# Altium schematic sheet HydrophoneGroup2FilterAndAmpCircuit.SchDoc
size C
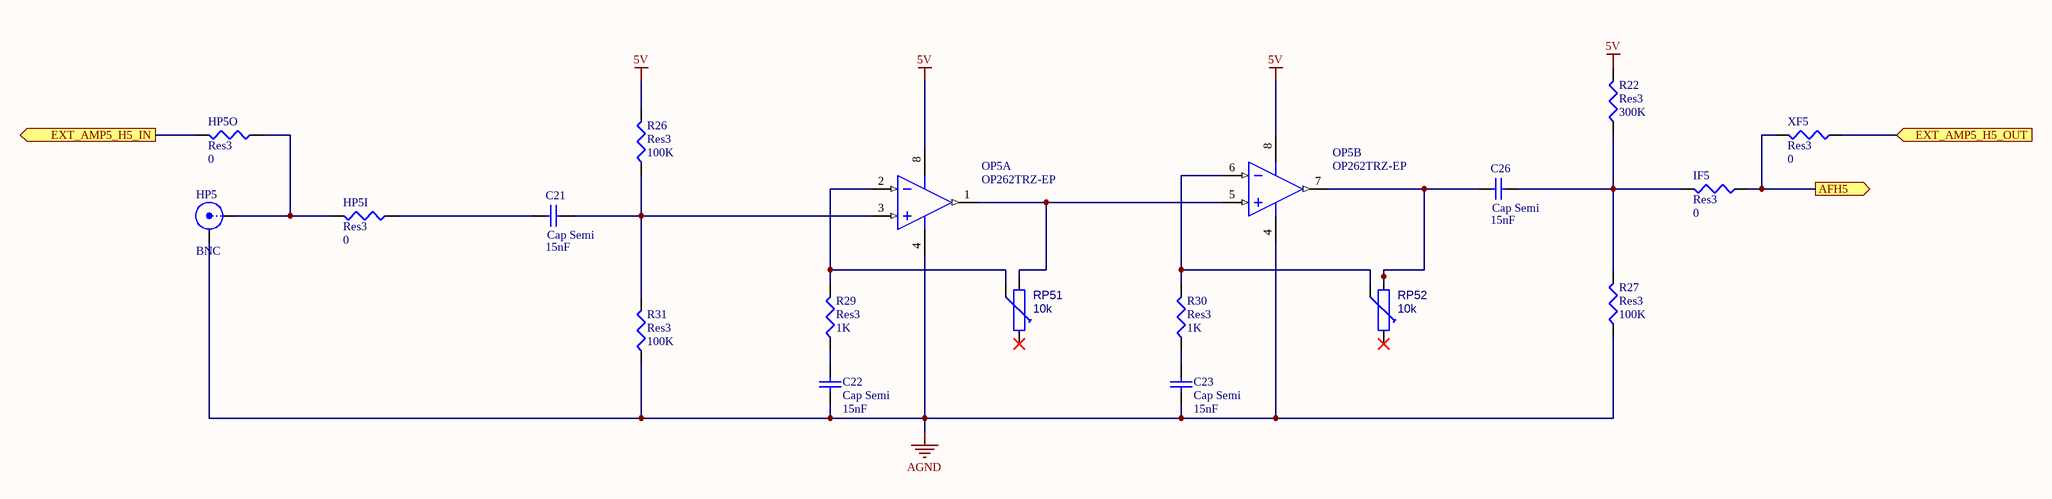
[diagram p0: HydrophoneGroup2FilterAndAmpCircuit.SchDoc]

## Parts
C21  Cap Semi  value 15nF  [C0805]
C22  Cap Semi  value 15nF  [C0805]
C23  Cap Semi  value 15nF  [C0805]
C26  Cap Semi  value 15nF  [C0805]
HP5  BNC  [BNC_RA CON]
HP5I  Res3  value 0  [J1-0603]
HP5O  Res3  value 0  [J1-0603]
IF5  Res3  value 0  [J1-0603]
OP5  OP262TRZ-EP  [ADI-R-8_N]  (parts A,B of 2)
R22  Res3  value 300K  [J1-0603]
R26  Res3  value 100K  [J1-0603]
R27  Res3  value 100K  [J1-0603]
R29  Res3  value 1K  [J1-0603]
R30  Res3  value 1K  [J1-0603]
R31  Res3  value 100K  [J1-0603]
RP51  10k  [Trim_Bourns3296]
RP52  10k  [Trim_Bourns3296]
XF5  Res3  value 0  [J1-0603]

## Ports
AFH5 (out), EXT_AMP5_H5_IN (out), EXT_AMP5_H5_OUT (in)

## Nets
5V: OP5.8(+V) R22.2 R26.2
AGND: C22.1 C23.1 HP5.2(Y) OP5.4(-V) R27.1 R31.1
AFH5: IF5.1 XF5.2 ; port AFH5
EXT_AMP5_H5_IN: HP5O.2 ; port EXT_AMP5_H5_IN
EXT_AMP5_H5_OUT: XF5.1 ; port EXT_AMP5_H5_OUT
NetC21_1: C21.1 HP5I.1
NetC21_2: C21.2 OP5.3(+IN_A) R26.1 R31.2
NetC22_2: C22.2 R29.1
NetC23_2: C23.2 R30.1
NetC26_1: C26.1 OP5.7(OUT_B) RP52.1
NetC26_2: C26.2 IF5.2 R22.1 R27.2
NetHP5_1: HP5.1(X) HP5I.2 HP5O.1
NetOP5_1: OP5.1(OUT_A) OP5.5(+IN_B) RP51.1
NetOP5_2: OP5.2(-IN_A) R29.2 RP51.2
NetOP5_6: OP5.6(-IN_B) R30.2 RP52.2

Not connected (* = marked no-connect by the designer): RP51 3*; RP52 3*

## Library data of the parts
C21-C23 C26 = Cap Semi: Capacitor (Semiconductor SIM Model); Published: 8-Jun-2000; LatestRevisionDate: 29-May-2009; LatestRevisionNote: IPC-7351 Footprint Added.; PackageReference: C1206; Publisher: Altium Limited; PackageDescription: Chip Capacitor
HP5 = BNC: BNC Elbow Connector; LatestRevisionDate: 17-Jul-2002; LatestRevisionNote: Re-released for DXP Platform.; Publisher: Altium Limited
HP5I HP5O IF5 R22 R26 R27 R29-R31 XF5 = Res3: Resistor; Published: 8-Jun-2000; LatestRevisionDate: 29-May-2009; LatestRevisionNote: IPC-7351 Footprint Added.; PackageReference: J1-0603; Publisher: Altium Limited; PackageDescription: Chip Resistor
OP5 = OP262TRZ-EP: Double Channel Wide Bandwidth Operational Amplifier, 15 MHz BW, 13 V/us SR, Military, 8-pin SOIC (R-8), Tube; Generic Part Number: OP262; Manufacturer: Analog Devices; Amplifiers Per Package: 2; Input Bias Current: 260nA; Input Offset Voltage: 25uV; Iq/Amp: 775uA; Slew Rate: 13V/us; Small Signal Bandwidth: 15MHz; V Span Max: 12V; V Span Min: 2.7V; DatasheetVersion: Rev. G; PackageVersion: 060506-A; PackageReference: R-8; PackageDescription: 8-Pin Standard Small Outline Package, Body 3.9 x 4.9 mm, Pitch 1.27 mm; Supplier 1: Digi-Key; Supplier Part Number 1: OP262TRZ-EP-ND; Supplier 2: Newark; Supplier Part Number 2: 85R9009; Packing: Tube; Mounting Technology: Surface Mount; Code_JEDEC: MS-012-AA; PartNumber: OP262TRZ-EP; ComponentLink1Description: Manufacturer URL; ComponentLink1URL: http://www.analog.com/en/index.html; ComponentLink2Description: Datasheet; ComponentLink2URL: http://www.analog.com/static/imported-files/data_sheets/OP162_262_462.pdf; ComponentLink3Description: Package Specification; ComponentLink3URL: http://www.analog.com/static/imported-files/packages/PKG_PDF/SOIC_Narrow%20(R)/R_8.pdf
RP51 RP52 = RES_Trim: Resistor Trimmer; Part_Number: RES_Trim_Bourns3296; Part Description: Trimmer, Bourns 3296 0.5W; Mfr Part Number: Bourns 3296Y-1-xxxLF; Validated: False; Value: 10k; Type: RES; Distributor info: RS 3296Y-1-xxxLF (1k=3296Y-1-102LF); Price: 2,03; ComponentLink1Description: Manufacturer; ComponentLink1URL: http://bourns.de/; Creation Date: 05.12.2011; IPC: False